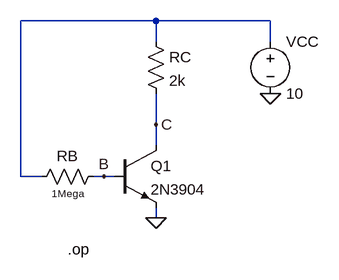
[diagram p0: schematic 004 TJB.asc]
004 TJB.asc, the LTspice schematic file:
Version 4
SHEET 1 880 680
WIRE 160 -80 -48 -80
WIRE 336 -80 160 -80
WIRE 160 -48 160 -80
WIRE 336 -48 336 -80
WIRE 160 80 160 32
WIRE 160 112 160 80
WIRE -48 160 -48 -80
WIRE -16 160 -48 160
WIRE 80 160 64 160
WIRE 96 160 80 160
WIRE 160 224 160 208
FLAG 336 32 0
FLAG 160 80 C
FLAG 80 160 B
FLAG 160 224 0
SYMBOL npn 96 112 R0
SYMATTR InstName Q1
SYMATTR Value 2N3904
SYMBOL voltage 336 -64 R0
SYMATTR InstName VCC
SYMATTR Value 10
SYMBOL res 144 -64 R0
SYMATTR InstName RC
SYMATTR Value 2k
SYMBOL res 80 144 R90
WINDOW 0 0 56 VBottom 2
WINDOW 3 32 56 VTop 1
SYMATTR InstName RB
SYMATTR Value 1Mega
TEXT 24 272 Left 2 !.op

The netlist it stands for:
* 004 TJB.asc
Q1 C B 0 0 2N3904
VCC N001 0 10
RC N001 C 2k
RB B N001 1Mega
.model NPN NPN
.model PNP PNP
.lib standard.bjt
.op
.backanno
.end